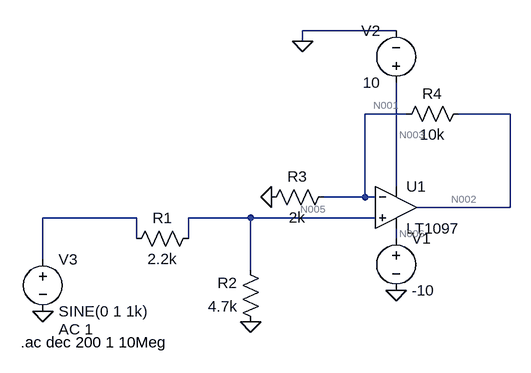
[diagram p0: schematic Draft5.asc]
Draft5.asc, the LTspice schematic file:
Version 4
SHEET 1 880 680
WIRE 480 -160 336 -160
WIRE 336 -144 336 -160
WIRE 496 -32 432 -32
WIRE 656 -32 576 -32
WIRE 480 80 480 -80
WIRE 432 96 432 -32
WIRE 432 96 368 96
WIRE 448 96 432 96
WIRE 656 112 656 -32
WIRE 656 112 512 112
WIRE 80 128 -64 128
WIRE 256 128 160 128
WIRE 448 128 256 128
WIRE 80 160 80 128
WIRE 160 160 160 128
WIRE 480 160 480 144
WIRE -64 192 -64 128
WIRE 256 208 256 128
FLAG 288 96 0
FLAG 480 240 0
FLAG 336 -144 0
FLAG 256 288 0
FLAG -64 272 0
SYMBOL res 176 144 R90
WINDOW 0 0 56 VBottom 2
WINDOW 3 32 56 VTop 2
SYMATTR InstName R1
SYMATTR Value 2.2k
SYMBOL res 272 304 R180
WINDOW 0 36 76 Left 2
WINDOW 3 36 40 Left 2
SYMATTR InstName R2
SYMATTR Value 4.7k
SYMBOL res 272 112 R270
WINDOW 0 32 56 VTop 2
WINDOW 3 0 56 VBottom 2
SYMATTR InstName R3
SYMATTR Value 2k
SYMBOL res 480 -16 R270
WINDOW 0 32 56 VTop 2
WINDOW 3 0 56 VBottom 2
SYMATTR InstName R4
SYMATTR Value 10k
SYMBOL Opamps\\LT1097 480 48 R0
SYMATTR InstName U1
SYMBOL voltage 480 144 R0
WINDOW 123 0 0 Left 0
WINDOW 39 0 0 Left 0
SYMATTR InstName V1
SYMATTR Value -10
SYMBOL voltage 480 -64 R180
WINDOW 0 24 96 Left 2
WINDOW 3 24 16 Left 2
WINDOW 123 0 0 Left 0
WINDOW 39 0 0 Left 0
SYMATTR InstName V2
SYMATTR Value 10
SYMBOL voltage -64 176 R0
WINDOW 123 24 124 Left 2
WINDOW 39 0 0 Left 0
SYMATTR InstName V3
SYMATTR Value SINE(0 1 1k)
SYMATTR Value2 AC 1
TEXT -98 320 Left 2 !.ac dec 200 1 10Meg

The netlist it stands for:
* Draft5.asc
R1 N005 N004 2.2k
R2 0 N005 4.7k
R3 0 N001 2k
R4 N001 N002 10k
XU1 N005 N001 N003 N006 N002 LT1097  ; pins In+ In- V+ V- OUT
V1 N006 0 -10
V2 N003 0 10
V3 N004 0 SINE(0 1 1k) AC 1
.ac dec 200 1 10Meg
.backanno
.end

* Results of the author's LTspice run, read from the files saved beside the schematic
* Operating Point, zero values left out:
*   V(n003) = 10 V
*   V(n006) = -10 V
*   I(V2) = -349.8 µA
*   I(V1) = 349.8 µA
*   Ix(u1:3) = 349.8 µA
*   Ix(u1:4) = -349.8 µA
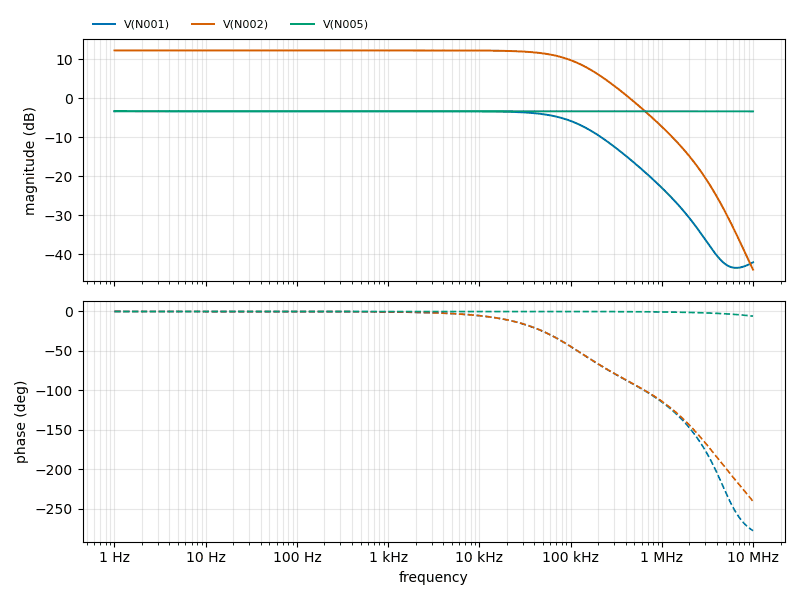
[diagram p1: AC Analysis of Draft5.asc, plotted from the saved traces]
* AC Analysis, 1 run:
*   V(N001): -3.34 dB at 1 Hz, -42.01 dB at 10 MHz, peak -3.34 dB at 1 Hz, 3 dB below the peak at 113.7 kHz
*   V(N002): 12.23 dB at 1 Hz, -43.90 dB at 10 MHz, peak 12.23 dB at 1 Hz, 3 dB below the peak at 113.7 kHz
*   V(N005): -3.34 dB at 1 Hz, -3.38 dB at 10 MHz, peak -3.33 dB at 335 kHz